# EasyEDA Pro project ProDoc_RiscArchive_SCH.epro

# Schematic CH32V003F4P6 rv003usb Dev Board
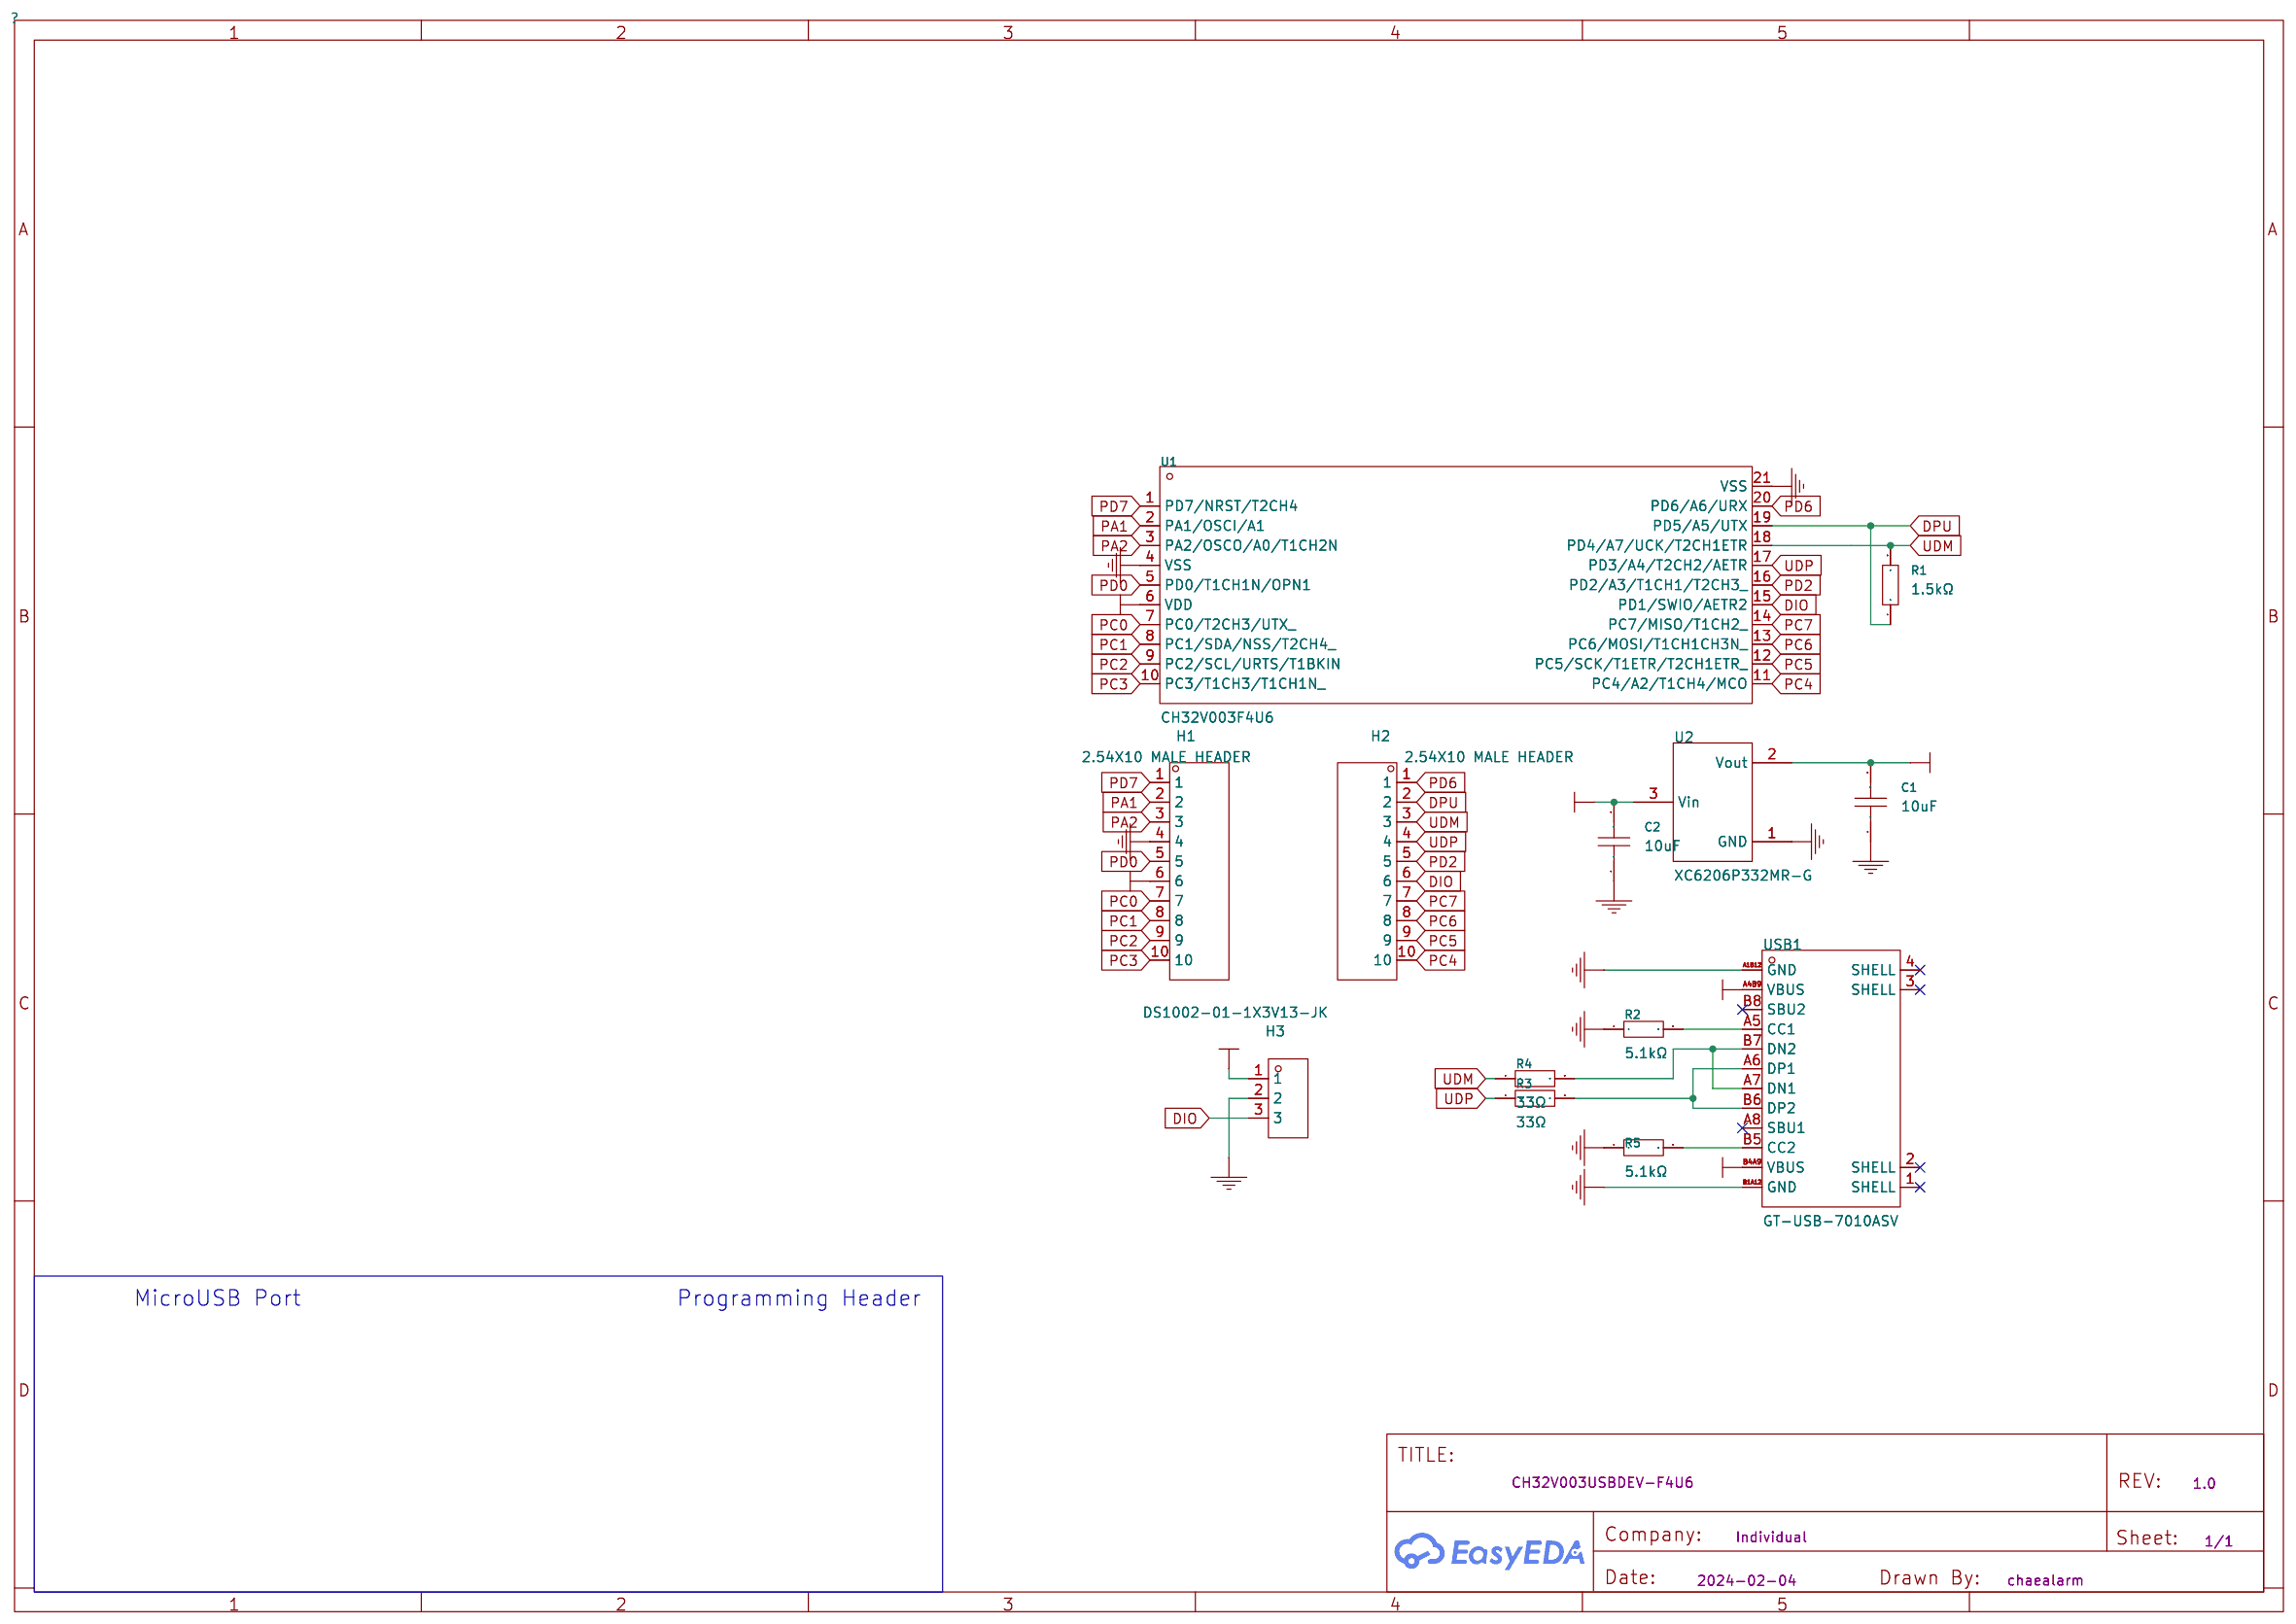
[diagram p0: schematic sheet]

## Parts
C1  10uF  [C0603]
C2  10uF  [C0603]
H1  2.54X10 MALE HEADER  [footprint_8cc6]
H2  2.54X10 MALE HEADER  [footprint_8cc6]
H3  DS1002-01-1X3V13-JK  [footprint_da6f]
R1  1.5kΩ  [R0402]
R2  5.1kΩ  [R0402]
R3  33Ω  [R0402]
R4  33Ω  [R0402]
R5  5.1kΩ  [R0402]
U1  CH32V003F4U6  [QFN-20_L3.0-W3.0-P0.40-TL-EP1.7]
U2  XC6206P332MR-G  [SOT-23-3_L2.9-W1.6-P1.90-LS2.8-BR]
USB1  GT-USB-7010ASV  [USB-C-SMD_G-SWITCH_GT-USB-7010ASV]

## Library data of the parts
C1 C2 = CL10A106KP8NNNC: Capacitance: Tolerance:±10% Tolerance:±10% Voltage Rated: Temperature Coefficient:; LCSC Part Name: 10uF ±10% 10V; Supplier Part: C19702; Manufacturer: SAMSUNG(三星); Supplier Footprint: 0603; JLCPCB Part Class: Basic Part; Datasheet: https://atta.szlcsc.com/upload/public/pdf/source/20160218/1457707763339.pdf; Supplier: LCSC; Tolerance: ±10%
H1 H2 = 2.54X10 MALE HEADER: Supplier: LCSC; Manufacturer: Ckmtw; Manufacturer Part: 210S-1*11P L=11.6MMGold-plated black; Supplier Part: C124372
H3 = DS1002-01-1X3V13-JK: Supplier: LCSC; Supplier Part: C7495228; Manufacturer: CONNFLY; Manufacturer Part: DS1002-01-1x3V13-JK
R1 = 0402WGF1501TCE: Type:Thick Film Resistors Resistance:1.5kΩ Tolerance:±1% Tolerance:±1% Power(Watts): Overload Voltage (Max): Temperature Coefficient:±100ppm/℃ Temperature Coefficient:±100ppm/℃ Operating Temperature Range:-55℃~+155℃ Operating Temperature Range:-55℃~+155℃; LCSC Part Name: 1.5kΩ ±1% 62.5mW 厚膜电阻; Supplier Part: C25867; Manufacturer: UNI-ROYAL(厚声); Supplier Footprint: 0402; JLCPCB Part Class: Basic Part; Datasheet: https://atta.szlcsc.com/upload/public/pdf/source/20200306/C422600_1E6D84923E4A46A82E41ADD87F860B5C.pdf; Supplier: LCSC; Type: Thick Film Resistors; Tolerance: ±1%; Temperature Coefficient: ±100ppm/℃; Operating Temperature Range: -55℃~+155℃
R2 R5 = 0402WGF5101TCE: Type:Thick Film Resistors Resistance:5.1kΩ Tolerance:±1% Tolerance:±1% Power(Watts): Overload Voltage (Max): Temperature Coefficient:±100ppm/℃ Temperature Coefficient:±100ppm/℃ Operating Temperature Range:-55℃~+155℃ Operating Temperature Range:-55℃~+155℃; LCSC Part Name: 5.1kΩ ±1% 62.5mW 厚膜电阻; Supplier Part: C25905; Manufacturer: UNI-ROYAL(厚声); Supplier Footprint: 0402; JLCPCB Part Class: Basic Part; Datasheet: https://atta.szlcsc.com/upload/public/pdf/source/20200306/C422600_1E6D84923E4A46A82E41ADD87F860B5C.pdf; Supplier: LCSC; Type: Thick Film Resistors; Tolerance: ±1%; Temperature Coefficient: ±100ppm/℃; Operating Temperature Range: -55℃~+155℃
R3 R4 = 0402WGF330JTCE: Type:Thick Film Resistors Resistance:33Ω Tolerance:±1% Tolerance:±1% Power(Watts): Overload Voltage (Max): Temperature Coefficient:±100ppm/℃ Temperature Coefficient:±100ppm/℃ Operating Temperature Range:-55℃~+155℃ Operating Temperature Range:-55℃~+155℃; LCSC Part Name: 33Ω ±1% 62.5mW 厚膜电阻; Supplier Part: C25105; Manufacturer: UNI-ROYAL(厚声); Supplier Footprint: 0402; JLCPCB Part Class: Basic Part; Datasheet: https://atta.szlcsc.com/upload/public/pdf/source/20200306/C422600_1E6D84923E4A46A82E41ADD87F860B5C.pdf; Supplier: LCSC; Type: Thick Film Resistors; Tolerance: ±1%; Temperature Coefficient: ±100ppm/℃; Operating Temperature Range: -55℃~+155℃
U1 = CH32V003F4U6: CPU Core:RISC-V Program Storage Size:16KB RAM Size:2KB GPIO Ports Number:18 Operating Voltage Range:- Operating Voltage Range:- CPU Maximum Speed:48MHz Program Memory Type:- Operating Temperature Range:- Operating Temperature Range:- ADC (Bit):- DAC (Bit); Supplier Part: C5299908; Manufacturer: WCH(南京沁恒); Supplier Footprint: QFN-20(3X3); JLCPCB Part Class: Extended Part; Datasheet: https://atta.szlcsc.com/upload/public/pdf/source/20230221/03A183181E3A5B8E6C6F9D2EA4AA4BE3.pdf; Supplier: LCSC; CPU Core: RISC-V; Program Storage Size: 16KB; RAM Size: 2KB; GPIO Ports Number: 18; CPU Maximum Speed: 48MHz; UART/USART: 1; I2C: 1; SPI: 1; Watchdog: 有; Real-Time Clock: 有
U2 = XC6206P332MR-G_C5446: Output Type: Maximum Input Voltage:6V Output Voltage:3.3V Output Voltage:3.3V MAX Output Current:200mA Power Supply Rejection Ratio (PSRR):- Dropout Voltage:680mV@(100mA) Output Polarity:Positive electrode Number of Outputs:1; LCSC Part Name: 输入6V 输出3.3V 200mA; Supplier Part: C5446; Manufacturer: TOREX(特瑞仕); Supplier Footprint: SOT-23-3L; JLCPCB Part Class: Basic Part; Datasheet: https://atta.szlcsc.com/upload/public/pdf/source/20130823/1457706639850.pdf; Supplier: LCSC; Maximum Input Voltage: 6V; Output Voltage: 3.3V; MAX Output Current: 200mA; Dropout Voltage: 680mV@(100mA); Output Polarity: Positive electrode; Number of Outputs: 1
USB1 = GT-USB-7010ASV: Connector Type:Type-C Standard:USB 2.0 Gender:Female Number of Ports:1 Number of Contacts:16P Mounting Style:卧贴 Current Rating - Power (Max):3A Contact Material:高导铜 Contact Plating:Gold Operating Temperature Range:-40℃~+85℃ Operating Temperature Range:-40; LCSC Part Name: Type-C 母 卧贴; Supplier Part: C2988369; Manufacturer: G-Switch(品赞); Supplier Footprint: SMD; JLCPCB Part Class: Extended Part; Datasheet: https://atta.szlcsc.com/upload/public/pdf/source/20230327/DF227B64686AC8FA0AD1775797F2C3F1.pdf; Supplier: LCSC; Connector Type: Type-C; Standard: USB 2.0; Gender: Female; Number of Ports: 1; Number of Contacts: 16P; Mounting Style: 卧贴; Current Rating - Power (Max): 3A; Contact Material: 高导铜; Contact Plating: Gold; Operating Temperature Range: -40℃~+85℃; Soldering Temperature(Max): 260℃

## Nets
+3V3: C1.2 H1.6 H3.1 U1.6(VDD) U2.2(Vout)
+5V: C2.2 U2.3(Vin) USB1.A4B9(VBUS) USB1.B4A9(VBUS)
GND: C1.1 C2.1 H1.4 H3.2 R2.1 R5.1 U1.4(VSS) U1.21(VSS) U2.1(GND) USB1.A1B12(GND) USB1.B1A12(GND)
DIO: H2.6 H3.3 U1.15(PD1/SWIO/AETR2)
DPU: H2.2 R1.1 U1.19(PD5/A5/UTX)
PA1: H1.2 U1.2(PA1/OSCI/A1)
PA2: H1.3 U1.3(PA2/OSCO/A0/T1CH2N)
PC0: H1.7 U1.7(PC0/T2CH3/UTX_)
PC1: H1.8 U1.8(PC1/SDA/NSS/T2CH4_)
PC2: H1.9 U1.9(PC2/SCL/URTS/T1BKIN)
PC3: H1.10 U1.10(PC3/T1CH3/T1CH1N_)
PC4: H2.10 U1.11(PC4/A2/T1CH4/MCO)
PC5: H2.9 U1.12(PC5/SCK/T1ETR/T2CH1ETR_)
PC6: H2.8 U1.13(PC6/MOSI/T1CH1CH3N_)
PC7: H2.7 U1.14(PC7/MISO/T1CH2_)
PD0: H1.5 U1.5(PD0/T1CH1N/OPN1)
PD2: H2.5 U1.16(PD2/A3/T1CH1/T2CH3_)
PD6: H2.1 U1.20(PD6/A6/URX)
PD7: H1.1 U1.1(PD7/NRST/T2CH4)
UDM: H2.3 R1.2 R4.1 U1.18(PD4/A7/UCK/T2CH1ETR)
UDP: H2.4 R3.1 U1.17(PD3/A4/T2CH2/AETR)
Net-(R2-2): R2.2 USB1.A5(CC1)
Net-(R3-2): R3.2 USB1.A6(DP1) USB1.B6(DP2)
Net-(R4-2): R4.2 USB1.A7(DN1) USB1.B7(DN2)
Net-(R5-2): R5.2 USB1.B5(CC2)

Not connected (* = marked no-connect by the designer): USB1 1(SHELL)* 2(SHELL)* 3(SHELL)* 4(SHELL)* A8(SBU1)* B8(SBU2)*

## Notes on the sheet
- MicroUSB Port
- Programming Header
